# Altium schematic sheet LevelConverter.SchDoc
size A4; SheetNumber: 2; SheetTotal: 3; PageSetup: Record=PageOptions|CenterHorizontal=True|CenterVertical=True|PrintScale=1.00|XCorrection=1.00|YCorrection=1.00|PrintKind=0|BorderSize=5000000|LeftOffset=0|BottomOffset=0|Orientation=2|PaperLength=1000|PaperWidth=1000|Scale=100|PaperSource=7|PrintQuality=-3|MediaType=1|DitherType=10|PrintScaleMode=1|PaperKind=A4|PaperIndex=9
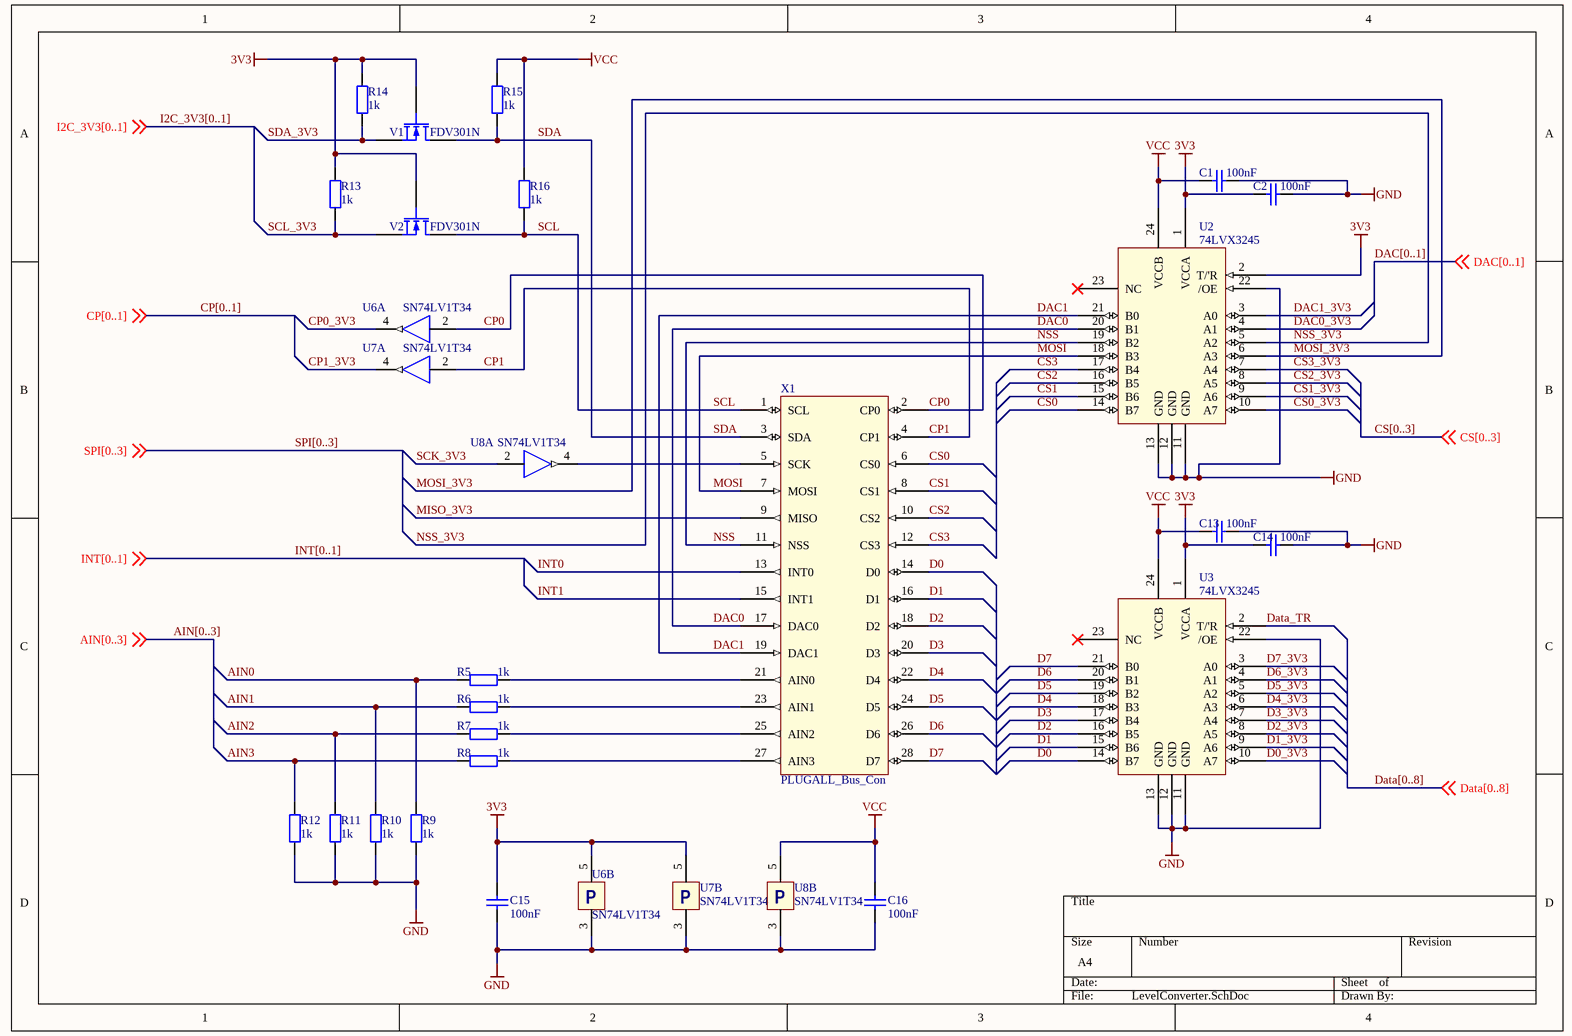
[diagram p0: LevelConverter.SchDoc]

## Parts
C1  value 100nF  [0805]  (hidden comment: C)
C2  value 100nF  [0805]  (hidden comment: C)
C13  value 100nF  [0805]  (hidden comment: C)
C14  value 100nF  [0805]  (hidden comment: C)
C15  value 100nF  [0805]  (hidden comment: C)
C16  value 100nF  [0805]  (hidden comment: C)
R5  value 1k  [R_0603]  (hidden comment: R)
R6  value 1k  [R_0603]  (hidden comment: R)
R7  value 1k  [R_0603]  (hidden comment: R)
R8  value 1k  [R_0603]  (hidden comment: R)
R9  value 1k  [R_0603]  (hidden comment: R)
R10  value 1k  [R_0603]  (hidden comment: R)
R11  value 1k  [R_0603]  (hidden comment: R)
R12  value 1k  [R_0603]  (hidden comment: R)
R13  value 1k  [R_0603]  (hidden comment: R)
R14  value 1k  [R_0603]  (hidden comment: R)
R15  value 1k  [R_0603]  (hidden comment: R)
R16  value 1k  [R_0603]  (hidden comment: R)
U2  74LVX3245  [TSSOP24]
U3  74LVX3245  [TSSOP24]
U6  SN74LV1T34  [DCK]  (parts A,B of 2)
U7  SN74LV1T34  [DCK]  (parts A,B of 2)
U8  SN74LV1T34  [DCK]  (parts A,B of 2)
V1  FDV301N  [SOT-23]
V2  FDV301N  [SOT-23]
X1  PLUGALL_Bus_Con  [CON14X2]

## Nets
3V3: C2.1 C14.1 C15.2 R13.2 R14.2 U2.1(VCCA) U2.2(T/'R) U3.1(VCCA) U6.5(VCC) U7.5(VCC) V1.2(G) V2.2(G)
GND: C1.2 C2.2 C13.2 C14.2 C15.1 C16.1 R9.1 R10.1 R11.1 R12.1 U2.11(GND) U2.12(GND) U2.13(GND) U2.22(/OE) U3.11(GND) U3.12(GND) U3.13(GND) U3.22(/OE) U6.3(GND) U7.3(GND) U8.3(GND)
VCC: C1.1 C13.1 C16.2 R15.2 R16.2 U2.24(VCCB) U3.24(VCCB) U8.5(VCC)
AIN0: R5.1 R9.2
AIN1: R6.1 R10.2
AIN2: R7.1 R11.2
AIN3: R8.1 R12.2
CP0: U6.2(IN) X1.2(CP0)
CP0_3V3: U6.4(OUT)
CP1: U7.2(IN) X1.4(CP1)
CP1_3V3: U7.4(OUT)
CS0: U2.14(B7) X1.6(CS0)
CS0_3V3: U2.10(A7)
CS1: U2.15(B6) X1.8(CS1)
CS1_3V3: U2.9(A6)
CS2: U2.16(B5) X1.10(CS2)
CS2_3V3: U2.8(A5)
CS3: U2.17(B4) X1.12(CS3)
CS3_3V3: U2.7(A4)
D0: U3.14(B7) X1.14(D0)
D0_3V3: U3.10(A7)
D1: U3.15(B6) X1.16(D1)
D1_3V3: U3.9(A6)
D2: U3.16(B5) X1.18(D2)
D2_3V3: U3.8(A5)
D3: U3.17(B4) X1.20(D3)
D3_3V3: U3.7(A4)
D4: U3.18(B3) X1.22(D4)
D4_3V3: U3.6(A3)
D5: U3.19(B2) X1.24(D5)
D5_3V3: U3.5(A2)
D6: U3.20(B1) X1.26(D6)
D6_3V3: U3.4(A1)
D7: U3.21(B0) X1.28(D7)
D7_3V3: U3.3(A0)
DAC0: U2.20(B1) X1.17(DAC0)
DAC0_3V3: U2.4(A1)
DAC1: U2.21(B0) X1.19(DAC1)
DAC1_3V3: U2.3(A0)
Data_TR: U3.2(T/'R)
INT0: X1.13(INT0)
INT1: X1.15(INT1)
MISO_3V3: X1.9(MISO)
MOSI: U2.18(B3) X1.7(MOSI)
MOSI_3V3: U2.6(A3)
NSS: U2.19(B2) X1.11(NSS)
NSS_3V3: U2.5(A2)
SCK_3V3: U8.2(IN)
SCL: R16.1 V2.1(D) X1.1(SCL)
SCL_3V3: R13.1 V2.3(S)
SDA: R15.1 V1.1(D) X1.3(SDA)
SDA_3V3: R14.1 V1.3(S)
NetR5_2: R5.2 X1.21(AIN0)
NetR6_2: R6.2 X1.23(AIN1)
NetR7_2: R7.2 X1.25(AIN2)
NetR8_2: R8.2 X1.27(AIN3)
NetU8_4: U8.4(OUT) X1.5(SCK)

Not connected (* = marked no-connect by the designer): U2 23(NC)*; U3 23(NC)*

## Buses and harness runs
bus AIN[0..3]
bus CP[0..1]
bus CS[0..3]
bus DAC[0..1]
bus Data[0..8]
bus I2C_3V3[0..1]
bus INT[0..1]
bus SPI[0..3]

## Notes on the sheet
- (in symbol SN74LV1T34, part B) P

## Library data of the parts
R5-R16 = RES_EU
V1 V2 = MOSFET-N: pin to pad: 1>3 2>1 3>2; Value: FDV301N
X1 = PLUGALL_Bus_Con: PLUGALL Card Connector; Value: 2x14
U2 U3 = 74LVX3245: Value: 74LVX3245
U6-U8 = SN74LV1T34: Value: SN74LV1T34